# Altium schematic sheet Main.SchDoc
size A4; Organization: Altium Limited; Address1: L3, 12a Rodborough Rd; Address2: Frenchs Forest; Address3: NSW; Address4: Australia 2086
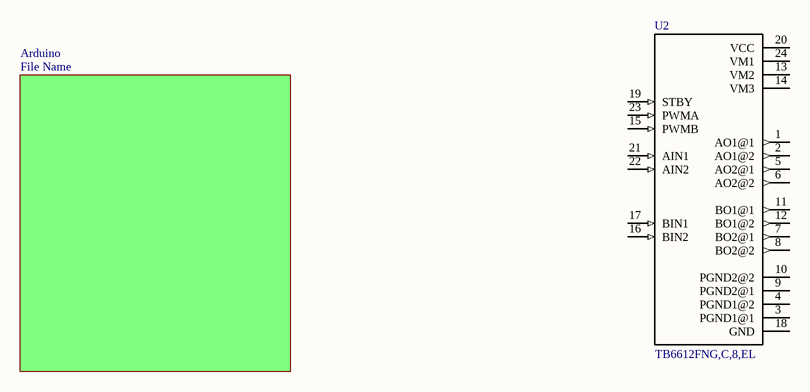
[diagram p0: Main.SchDoc]

## Parts
U2  TB6612FNG,C,8,EL  [SOP65P760X160-24N]

## Sub-sheets
Arduino = File Name: no entries

## Nets

Not connected (* = marked no-connect by the designer): U2 1(AO1@1) 2(AO1@2) 3(PGND1@1) 4(PGND1@2) 5(AO2@1) 6(AO2@2) 7(BO2@1) 8(BO2@2) 9(PGND2@1) 10(PGND2@2) 11(BO1@1) 12(BO1@2) 13(VM2) 14(VM3) 15(PWMB) 16(BIN2) 17(BIN1) 18(GND) 19(STBY) 20(VCC) 21(AIN1) 22(AIN2) 23(PWMA) 24(VM1)

## Notes on the sheet
- Title
- Size:
- Date:
- A4
- Number:
- Time:
- Revision:
- Sheet
- of
- File:

## Library data of the parts
U2 = TB6612FNG,C,8,EL: IC MOTOR DRIVER PAR 24SSOP; MF: Toshiba; Price: 1.39 USD; Availability: Good; MP: TB6612FNG,C,8,EL; Package: SSOP-24 Toshiba; Value: *